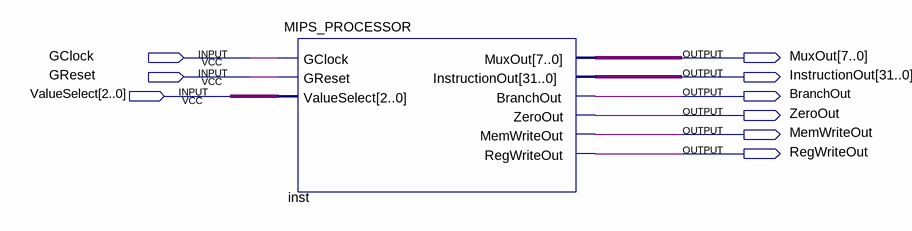
[diagram p0: schematic sheet]
// Quartus schematic TOP.bdf as structural Verilog: 1 symbols, 9 pins
module TOP (
  input  GClock,
  input  GReset,
  input  [2:0] ValueSelect,
  output [7:0] MuxOut,
  output [31:0] InstructionOut,
  output BranchOut,
  output ZeroOut,
  output MemWriteOut,
  output RegWriteOut
);

  MIPS_PROCESSOR inst (
    .GClock(GClock), .GReset(GReset), .ValueSelect(ValueSelect), .MuxOut(MuxOut),
    .InstructionOut(InstructionOut), .BranchOut(BranchOut), .ZeroOut(ZeroOut), .MemWriteOut(MemWriteOut),
    .RegWriteOut(RegWriteOut));
endmodule
